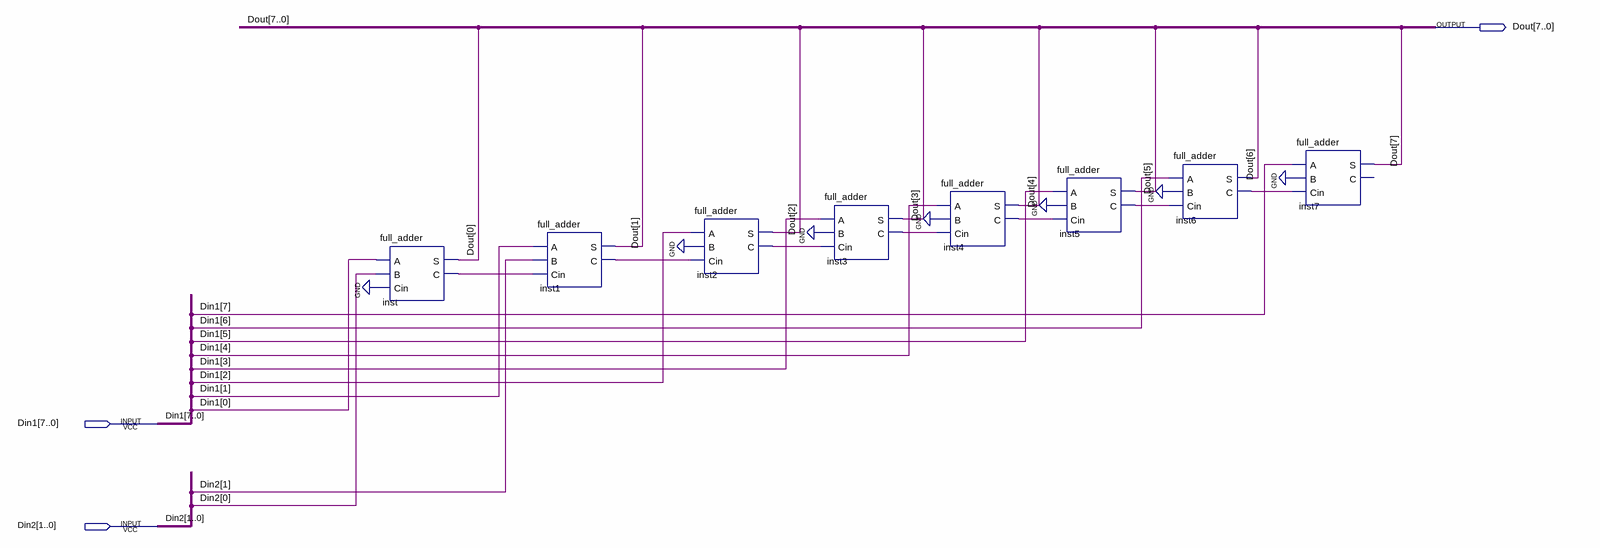
[diagram p0: schematic sheet]
// Quartus schematic adder_8bit_2bit.bdf as structural Verilog: 8 symbols, 3 pins
module adder_8bit_2bit (
  input  [7:0] Din1,
  input  [1:0] Din2,
  output [7:0] Dout
);

  wire inst1_c, inst2_c, inst3_c, inst4_c, inst5_c, inst6_c, inst_c;

  full_adder inst (.A(Din1[0]), .B(Din2[0]), .Cin(1'b0), .S(Dout[0]), .C(inst_c));
  full_adder inst1 (.A(Din1[1]), .B(Din2[1]), .Cin(inst_c), .S(Dout[1]), .C(inst1_c));
  full_adder inst2 (.A(Din1[2]), .B(1'b0), .Cin(inst1_c), .S(Dout[2]), .C(inst2_c));
  full_adder inst3 (.A(Din1[3]), .B(1'b0), .Cin(inst2_c), .S(Dout[3]), .C(inst3_c));
  full_adder inst4 (.A(Din1[4]), .B(1'b0), .Cin(inst3_c), .S(Dout[4]), .C(inst4_c));
  full_adder inst5 (.A(Din1[5]), .B(1'b0), .Cin(inst4_c), .S(Dout[5]), .C(inst5_c));
  full_adder inst6 (.A(Din1[6]), .B(1'b0), .Cin(inst5_c), .S(Dout[6]), .C(inst6_c));
  full_adder inst7 (.A(Din1[7]), .B(1'b0), .Cin(inst6_c), .S(Dout[7]));  // open: C
endmodule
